# EAGLE schematic DotModuleArduinoMegaShield (EAGLE 9.1.3)
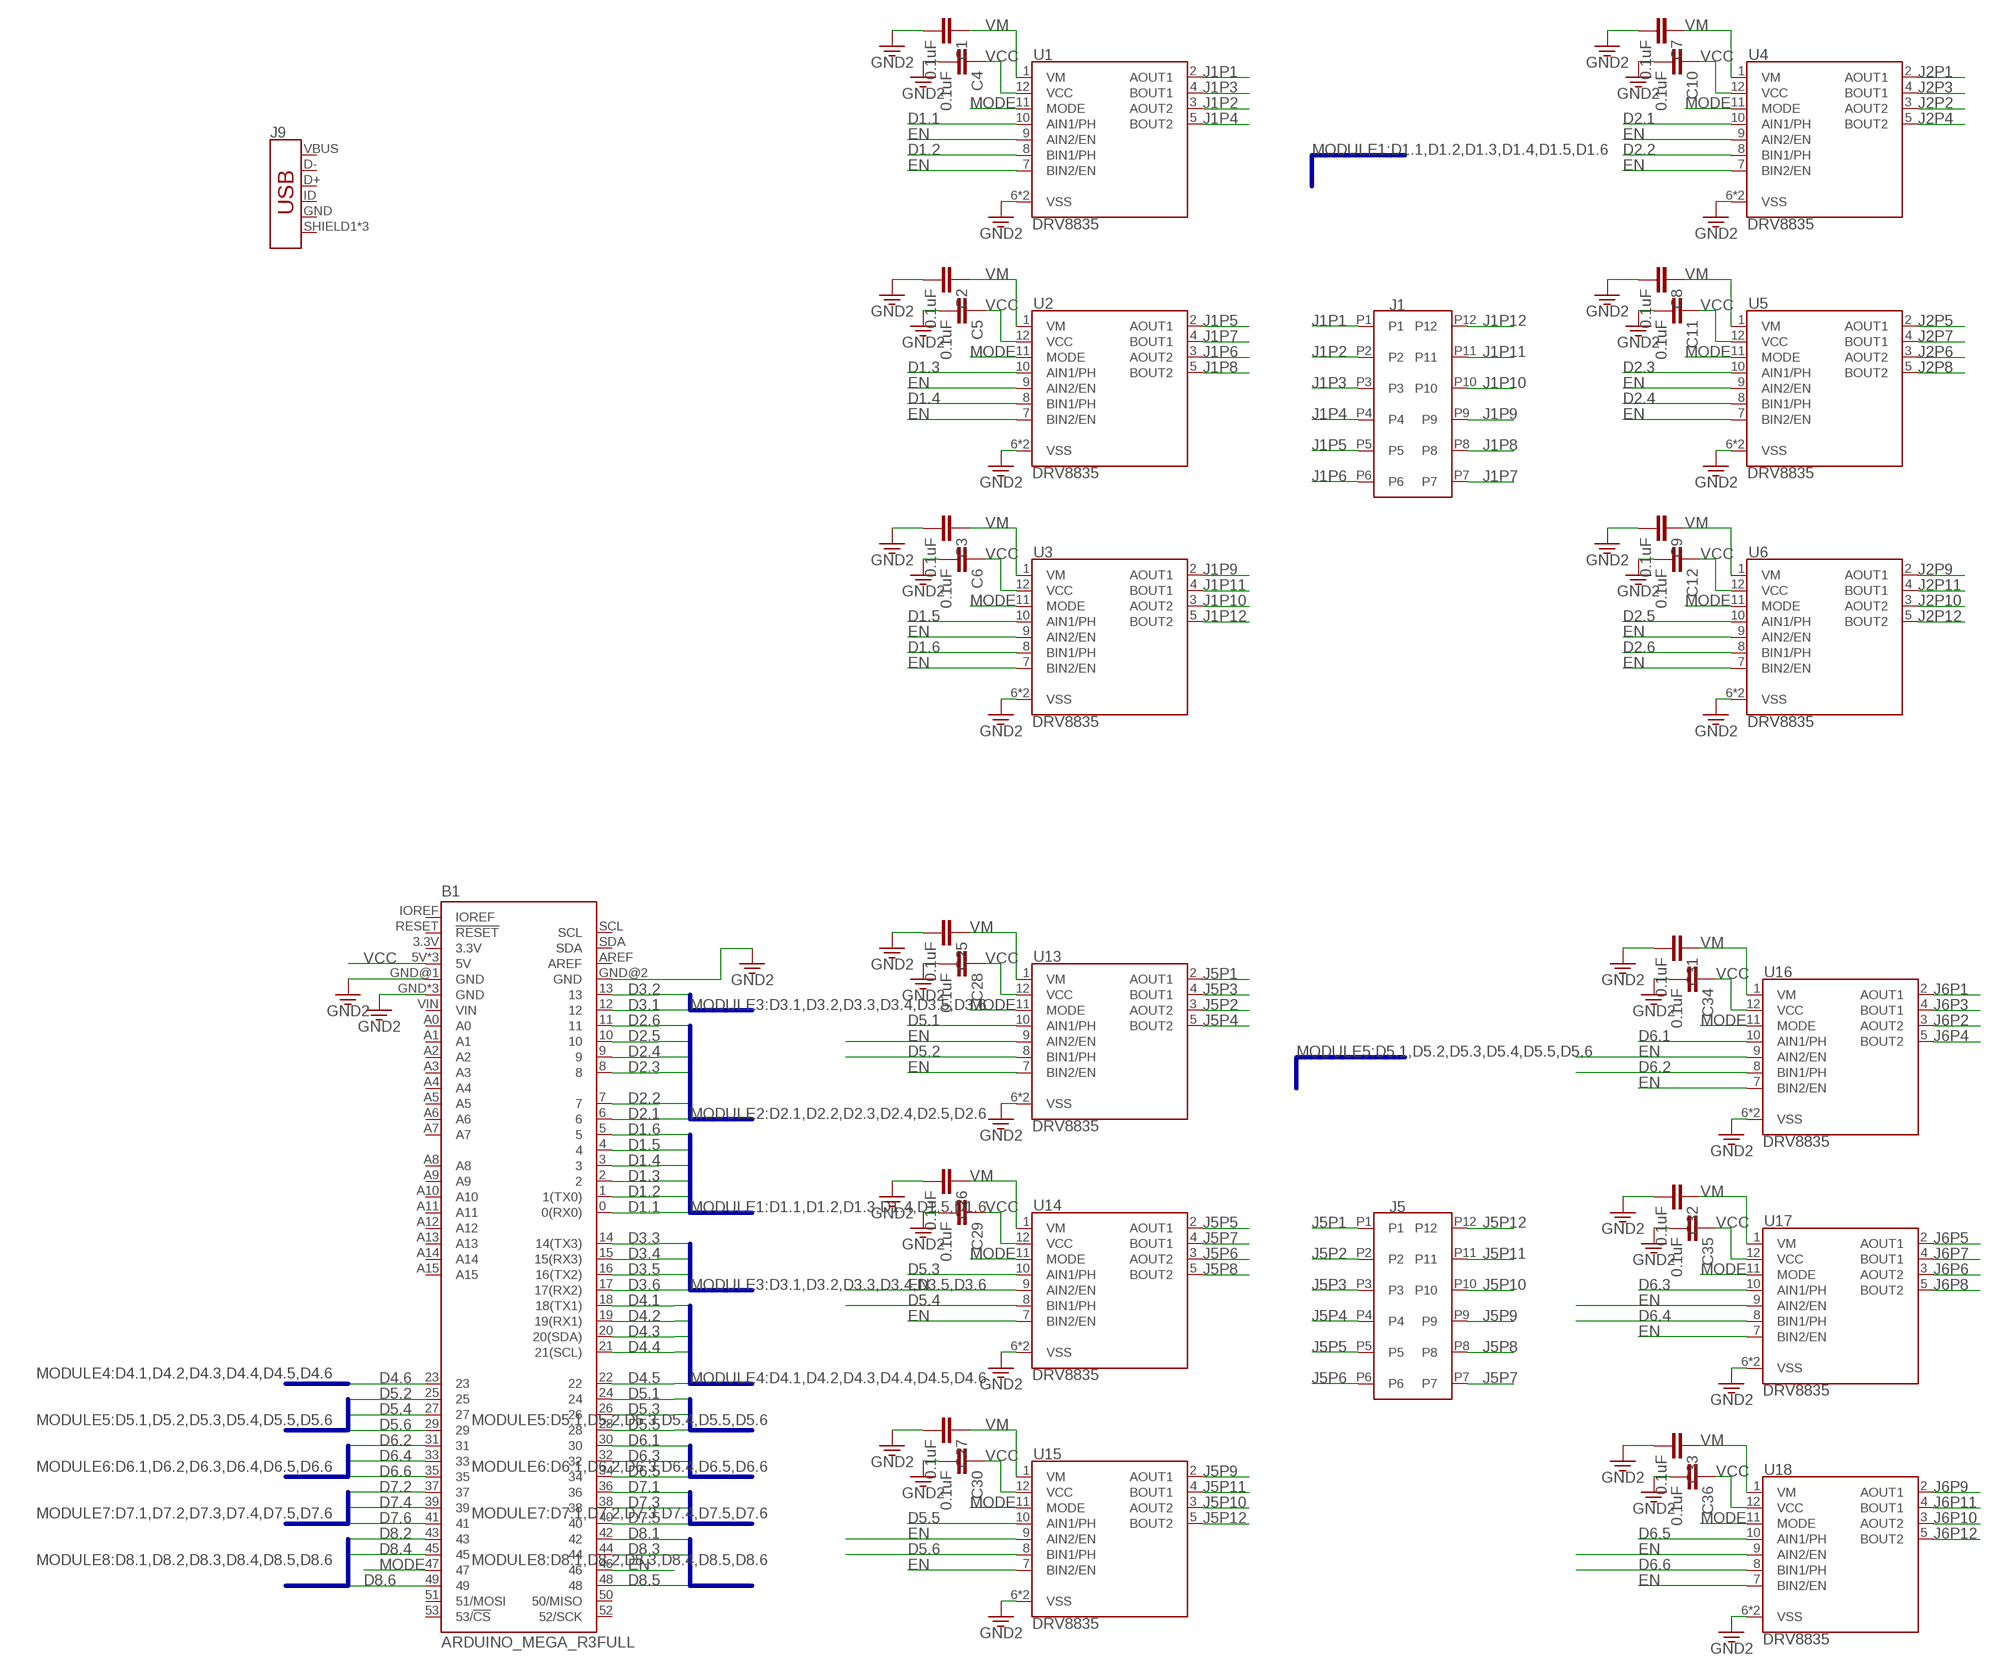
[diagram p0: schematic, sheet 1, part 1 of 2]
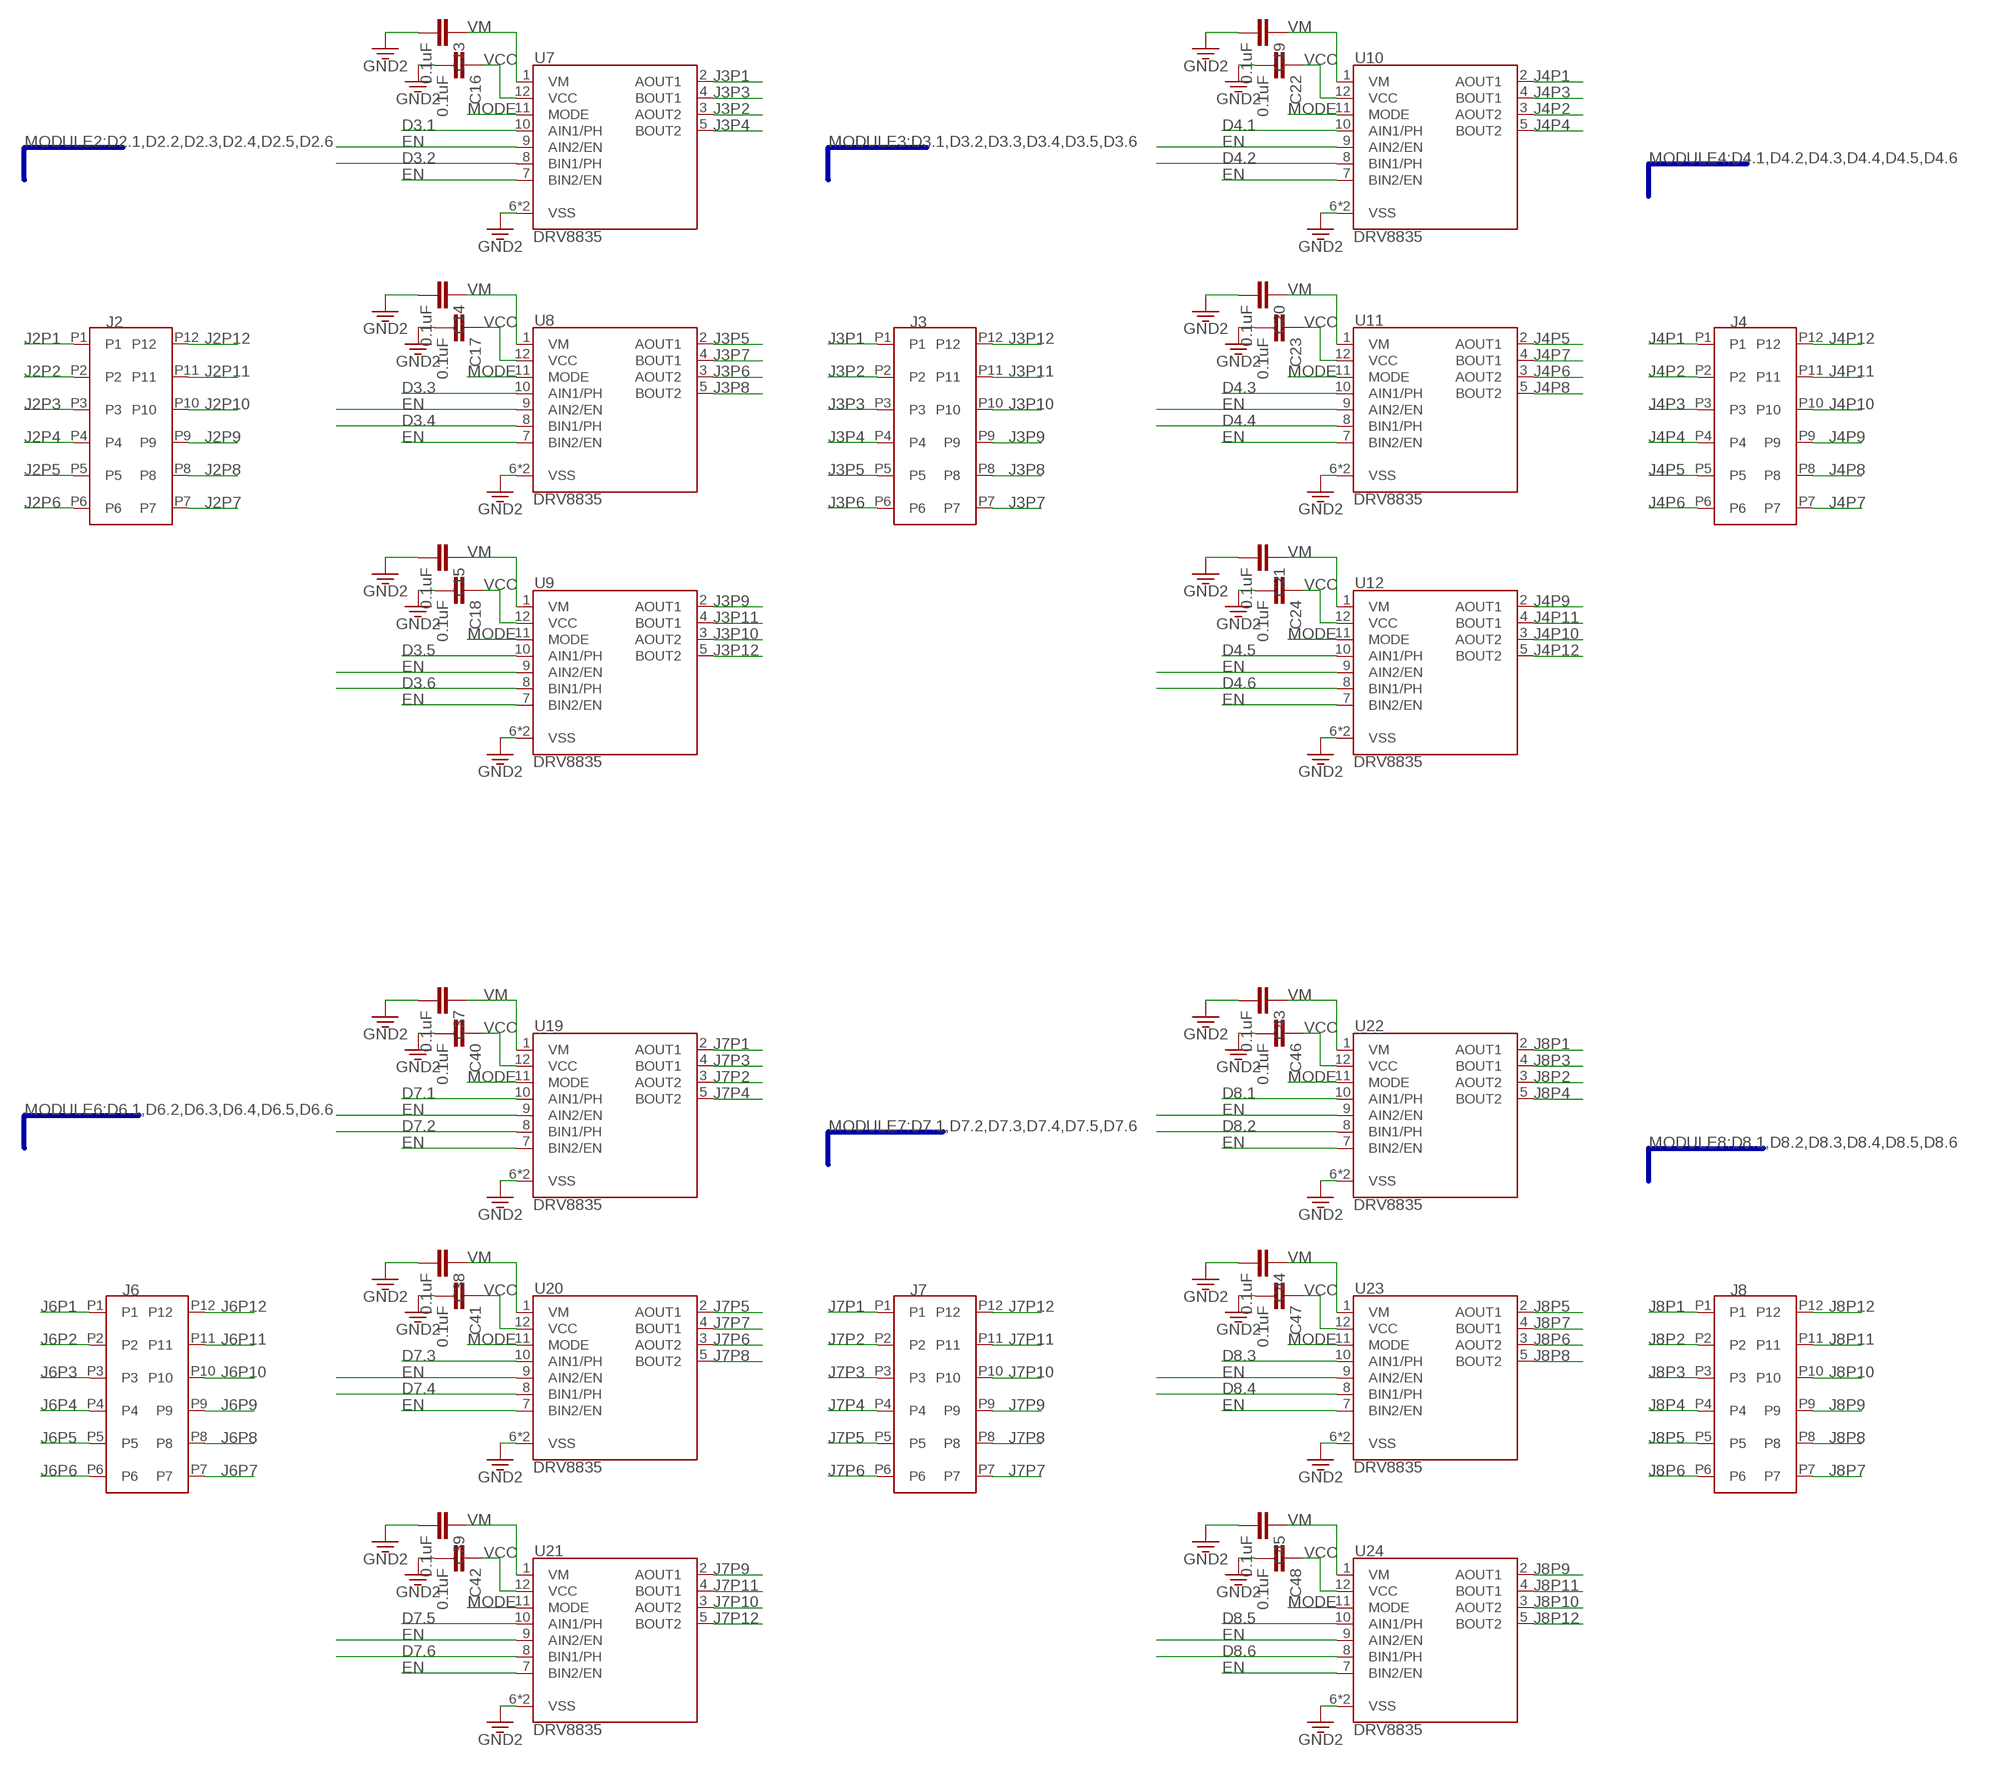
[diagram p1: schematic, sheet 1, part 2 of 2]

## Parts
B1  ARDUINO_MEGA_R3FULL  [ARDUINO_MEGA_NO_SILK]
C1  0.1uF  0.1UF-0402-16V-10%  [0402]
C2  0.1uF  0.1UF-0402-16V-10%  [0402]
C3  0.1uF  0.1UF-0402-16V-10%  [0402]
C4  0.1uF  0.1UF-0402-16V-10%  [0402]
C5  0.1uF  0.1UF-0402-16V-10%  [0402]
C6  0.1uF  0.1UF-0402-16V-10%  [0402]
C7  0.1uF  0.1UF-0402-16V-10%  [0402]
C8  0.1uF  0.1UF-0402-16V-10%  [0402]
C9  0.1uF  0.1UF-0402-16V-10%  [0402]
C10  0.1uF  0.1UF-0402-16V-10%  [0402]
C11  0.1uF  0.1UF-0402-16V-10%  [0402]
C12  0.1uF  0.1UF-0402-16V-10%  [0402]
C13  0.1uF  0.1UF-0402-16V-10%  [0402]
C14  0.1uF  0.1UF-0402-16V-10%  [0402]
C15  0.1uF  0.1UF-0402-16V-10%  [0402]
C16  0.1uF  0.1UF-0402-16V-10%  [0402]
C17  0.1uF  0.1UF-0402-16V-10%  [0402]
C18  0.1uF  0.1UF-0402-16V-10%  [0402]
C19  0.1uF  0.1UF-0402-16V-10%  [0402]
C20  0.1uF  0.1UF-0402-16V-10%  [0402]
C21  0.1uF  0.1UF-0402-16V-10%  [0402]
C22  0.1uF  0.1UF-0402-16V-10%  [0402]
C23  0.1uF  0.1UF-0402-16V-10%  [0402]
C24  0.1uF  0.1UF-0402-16V-10%  [0402]
C25  0.1uF  0.1UF-0402-16V-10%  [0402]
C26  0.1uF  0.1UF-0402-16V-10%  [0402]
C27  0.1uF  0.1UF-0402-16V-10%  [0402]
C28  0.1uF  0.1UF-0402-16V-10%  [0402]
C29  0.1uF  0.1UF-0402-16V-10%  [0402]
C30  0.1uF  0.1UF-0402-16V-10%  [0402]
C31  0.1uF  0.1UF-0402-16V-10%  [0402]
C32  0.1uF  0.1UF-0402-16V-10%  [0402]
C33  0.1uF  0.1UF-0402-16V-10%  [0402]
C34  0.1uF  0.1UF-0402-16V-10%  [0402]
C35  0.1uF  0.1UF-0402-16V-10%  [0402]
C36  0.1uF  0.1UF-0402-16V-10%  [0402]
C37  0.1uF  0.1UF-0402-16V-10%  [0402]
C38  0.1uF  0.1UF-0402-16V-10%  [0402]
C39  0.1uF  0.1UF-0402-16V-10%  [0402]
C40  0.1uF  0.1UF-0402-16V-10%  [0402]
C41  0.1uF  0.1UF-0402-16V-10%  [0402]
C42  0.1uF  0.1UF-0402-16V-10%  [0402]
C43  0.1uF  0.1UF-0402-16V-10%  [0402]
C44  0.1uF  0.1UF-0402-16V-10%  [0402]
C45  0.1uF  0.1UF-0402-16V-10%  [0402]
C46  0.1uF  0.1UF-0402-16V-10%  [0402]
C47  0.1uF  0.1UF-0402-16V-10%  [0402]
C48  0.1uF  0.1UF-0402-16V-10%  [0402]
J1  AXE612124-12PIN  [AXE612124-12PIN]
J2  AXE612124-12PIN  [AXE612124-12PIN]
J3  AXE612124-12PIN  [AXE612124-12PIN]
J4  AXE612124-12PIN  [AXE612124-12PIN]
J5  AXE612124-12PIN  [AXE612124-12PIN]
J6  AXE612124-12PIN  [AXE612124-12PIN]
J7  AXE612124-12PIN  [AXE612124-12PIN]
J8  AXE612124-12PIN  [AXE612124-12PIN]
J9  USB_MICRO-BREDUCED_PASTE  [USB-B-MICRO-SMD_RED_PASTE]
U1  DRV8835  DRV883X  [WSON-12]
U2  DRV8835  DRV883X  [WSON-12]
U3  DRV8835  DRV883X  [WSON-12]
U4  DRV8835  DRV883X  [WSON-12]
U5  DRV8835  DRV883X  [WSON-12]
U6  DRV8835  DRV883X  [WSON-12]
U7  DRV8835  DRV883X  [WSON-12]
U8  DRV8835  DRV883X  [WSON-12]
U9  DRV8835  DRV883X  [WSON-12]
U10  DRV8835  DRV883X  [WSON-12]
U11  DRV8835  DRV883X  [WSON-12]
U12  DRV8835  DRV883X  [WSON-12]
U13  DRV8835  DRV883X  [WSON-12]
U14  DRV8835  DRV883X  [WSON-12]
U15  DRV8835  DRV883X  [WSON-12]
U16  DRV8835  DRV883X  [WSON-12]
U17  DRV8835  DRV883X  [WSON-12]
U18  DRV8835  DRV883X  [WSON-12]
U19  DRV8835  DRV883X  [WSON-12]
U20  DRV8835  DRV883X  [WSON-12]
U21  DRV8835  DRV883X  [WSON-12]
U22  DRV8835  DRV883X  [WSON-12]
U23  DRV8835  DRV883X  [WSON-12]
U24  DRV8835  DRV883X  [WSON-12]

## Nets
3.3V: B1.GND@2(GND) ; supply symbol labelled GND2
D1.1: B1.0(0(RX0)) U1.10(AIN1/PH)
D1.2: B1.1(1(TX0)) U1.8(BIN1/PH)
D1.3: B1.2 U2.10(AIN1/PH)
D1.4: B1.3 U2.8(BIN1/PH)
D1.5: B1.4 U3.10(AIN1/PH)
D1.6: B1.5 U3.8(BIN1/PH)
D2.1: B1.6 U4.10(AIN1/PH)
D2.2: B1.7 U4.8(BIN1/PH)
D2.3: B1.8 U5.10(AIN1/PH)
D2.4: B1.9 U5.8(BIN1/PH)
D2.5: B1.10 U6.10(AIN1/PH)
D2.6: B1.11 U6.8(BIN1/PH)
D3.1: B1.12 U7.10(AIN1/PH)
D3.2: B1.13 U7.8(BIN1/PH)
D3.3: B1.14(14(TX3)) U8.10(AIN1/PH)
D3.4: B1.15(15(RX3)) U8.8(BIN1/PH)
D3.5: B1.16(16(TX2)) U9.10(AIN1/PH)
D3.6: B1.17(17(RX2)) U9.8(BIN1/PH)
D4.1: B1.18(18(TX1)) U10.10(AIN1/PH)
D4.2: B1.19(19(RX1)) U10.8(BIN1/PH)
D4.3: B1.20(20(SDA)) U11.10(AIN1/PH)
D4.4: B1.21(21(SCL)) U11.8(BIN1/PH)
D4.5: B1.22 U12.10(AIN1/PH)
D4.6: B1.23 U12.8(BIN1/PH)
D5.1: B1.24 U13.10(AIN1/PH)
D5.2: B1.25 U13.8(BIN1/PH)
D5.3: B1.26 U14.10(AIN1/PH)
D5.4: B1.27 U14.8(BIN1/PH)
D5.5: B1.28 U15.10(AIN1/PH)
D5.6: B1.29 U15.8(BIN1/PH)
D6.1: B1.30 U16.10(AIN1/PH)
D6.2: B1.31 U16.8(BIN1/PH)
D6.3: B1.32 U17.10(AIN1/PH)
D6.4: B1.33 U17.8(BIN1/PH)
D6.5: B1.34 U18.10(AIN1/PH)
D6.6: B1.35 U18.8(BIN1/PH)
D7.1: B1.36 U19.10(AIN1/PH)
D7.2: B1.37 U19.8(BIN1/PH)
D7.3: B1.38 U20.10(AIN1/PH)
D7.4: B1.39 U20.8(BIN1/PH)
D7.5: B1.40 U21.10(AIN1/PH)
D7.6: B1.41 U21.8(BIN1/PH)
D8.1: B1.42 U22.10(AIN1/PH)
D8.2: B1.43 U22.8(BIN1/PH)
D8.3: B1.44 U23.10(AIN1/PH)
D8.4: B1.45 U23.8(BIN1/PH)
D8.5: B1.48 U24.10(AIN1/PH)
D8.6: B1.49 U24.8(BIN1/PH)
EN: B1.46 U1.7(BIN2/EN) U1.9(AIN2/EN) U2.7(BIN2/EN) U2.9(AIN2/EN) U3.7(BIN2/EN) U3.9(AIN2/EN) U4.7(BIN2/EN) U4.9(AIN2/EN) U5.7(BIN2/EN) U5.9(AIN2/EN) U6.7(BIN2/EN) U6.9(AIN2/EN) U7.7(BIN2/EN) U7.9(AIN2/EN) U8.7(BIN2/EN) U8.9(AIN2/EN) U9.7(BIN2/EN) U9.9(AIN2/EN) U10.7(BIN2/EN) U10.9(AIN2/EN) U11.7(BIN2/EN) U11.9(AIN2/EN) U12.7(BIN2/EN) U12.9(AIN2/EN) U13.7(BIN2/EN) U13.9(AIN2/EN) U14.7(BIN2/EN) U14.9(AIN2/EN) U15.7(BIN2/EN) U15.9(AIN2/EN) U16.7(BIN2/EN) U16.9(AIN2/EN) U17.7(BIN2/EN) U17.9(AIN2/EN) U18.7(BIN2/EN) U18.9(AIN2/EN) U19.7(BIN2/EN) U19.9(AIN2/EN) U20.7(BIN2/EN) U20.9(AIN2/EN) U21.7(BIN2/EN) U21.9(AIN2/EN) U22.7(BIN2/EN) U22.9(AIN2/EN) U23.7(BIN2/EN) U23.9(AIN2/EN) U24.7(BIN2/EN) U24.9(AIN2/EN)
GND: B1.GND B1.GND@1(GND) B1.GND@3(GND) B1.GND@4(GND) C1.2 C2.2 C3.2 C4.2 C5.2 C6.2 C7.2 C8.2 C9.2 C10.2 C11.2 C12.2 C13.2 C14.2 C15.2 C16.2 C17.2 C18.2 C19.2 C20.2 C21.2 C22.2 C23.2 C24.2 C25.2 C26.2 C27.2 C28.2 C29.2 C30.2 C31.2 C32.2 C33.2 C34.2 C35.2 C36.2 C37.2 C38.2 C39.2 C40.2 C41.2 C42.2 C43.2 C44.2 C45.2 C46.2 C47.2 C48.2 U1.6(VSS) U1.PAD(VSS) U2.6(VSS) U2.PAD(VSS) U3.6(VSS) U3.PAD(VSS) U4.6(VSS) U4.PAD(VSS) U5.6(VSS) U5.PAD(VSS) U6.6(VSS) U6.PAD(VSS) U7.6(VSS) U7.PAD(VSS) U8.6(VSS) U8.PAD(VSS) U9.6(VSS) U9.PAD(VSS) U10.6(VSS) U10.PAD(VSS) U11.6(VSS) U11.PAD(VSS) U12.6(VSS) U12.PAD(VSS) U13.6(VSS) U13.PAD(VSS) U14.6(VSS) U14.PAD(VSS) U15.6(VSS) U15.PAD(VSS) U16.6(VSS) U16.PAD(VSS) U17.6(VSS) U17.PAD(VSS) U18.6(VSS) U18.PAD(VSS) U19.6(VSS) U19.PAD(VSS) U20.6(VSS) U20.PAD(VSS) U21.6(VSS) U21.PAD(VSS) U22.6(VSS) U22.PAD(VSS) U23.6(VSS) U23.PAD(VSS) U24.6(VSS) U24.PAD(VSS) ; supply symbol labelled GND2
J1P1: J1.P1 U1.2(AOUT1)
J1P2: J1.P2 U1.3(AOUT2)
J1P3: J1.P3 U1.4(BOUT1)
J1P4: J1.P4 U1.5(BOUT2)
J1P5: J1.P5 U2.2(AOUT1)
J1P6: J1.P6 U2.3(AOUT2)
J1P7: J1.P7 U2.4(BOUT1)
J1P8: J1.P8 U2.5(BOUT2)
J1P9: J1.P9 U3.2(AOUT1)
J1P10: J1.P10 U3.3(AOUT2)
J1P11: J1.P11 U3.4(BOUT1)
J1P12: J1.P12 U3.5(BOUT2)
J2P1: J2.P1 U4.2(AOUT1)
J2P2: J2.P2 U4.3(AOUT2)
J2P3: J2.P3 U4.4(BOUT1)
J2P4: J2.P4 U4.5(BOUT2)
J2P5: J2.P5 U5.2(AOUT1)
J2P6: J2.P6 U5.3(AOUT2)
J2P7: J2.P7 U5.4(BOUT1)
J2P8: J2.P8 U5.5(BOUT2)
J2P9: J2.P9 U6.2(AOUT1)
J2P10: J2.P10 U6.3(AOUT2)
J2P11: J2.P11 U6.4(BOUT1)
J2P12: J2.P12 U6.5(BOUT2)
J3P1: J3.P1 U7.2(AOUT1)
J3P2: J3.P2 U7.3(AOUT2)
J3P3: J3.P3 U7.4(BOUT1)
J3P4: J3.P4 U7.5(BOUT2)
J3P5: J3.P5 U8.2(AOUT1)
J3P6: J3.P6 U8.3(AOUT2)
J3P7: J3.P7 U8.4(BOUT1)
J3P8: J3.P8 U8.5(BOUT2)
J3P9: J3.P9 U9.2(AOUT1)
J3P10: J3.P10 U9.3(AOUT2)
J3P11: J3.P11 U9.4(BOUT1)
J3P12: J3.P12 U9.5(BOUT2)
J4P1: J4.P1 U10.2(AOUT1)
J4P2: J4.P2 U10.3(AOUT2)
J4P3: J4.P3 U10.4(BOUT1)
J4P4: J4.P4 U10.5(BOUT2)
J4P5: J4.P5 U11.2(AOUT1)
J4P6: J4.P6 U11.3(AOUT2)
J4P7: J4.P7 U11.4(BOUT1)
J4P8: J4.P8 U11.5(BOUT2)
J4P9: J4.P9 U12.2(AOUT1)
J4P10: J4.P10 U12.3(AOUT2)
J4P11: J4.P11 U12.4(BOUT1)
J4P12: J4.P12 U12.5(BOUT2)
J5P1: J5.P1 U13.2(AOUT1)
J5P2: J5.P2 U13.3(AOUT2)
J5P3: J5.P3 U13.4(BOUT1)
J5P4: J5.P4 U13.5(BOUT2)
J5P5: J5.P5 U14.2(AOUT1)
J5P6: J5.P6 U14.3(AOUT2)
J5P7: J5.P7 U14.4(BOUT1)
J5P8: J5.P8 U14.5(BOUT2)
J5P9: J5.P9 U15.2(AOUT1)
J5P10: J5.P10 U15.3(AOUT2)
J5P11: J5.P11 U15.4(BOUT1)
J5P12: J5.P12 U15.5(BOUT2)
J6P1: J6.P1 U16.2(AOUT1)
J6P2: J6.P2 U16.3(AOUT2)
J6P3: J6.P3 U16.4(BOUT1)
J6P4: J6.P4 U16.5(BOUT2)
J6P5: J6.P5 U17.2(AOUT1)
J6P6: J6.P6 U17.3(AOUT2)
J6P7: J6.P7 U17.4(BOUT1)
J6P8: J6.P8 U17.5(BOUT2)
J6P9: J6.P9 U18.2(AOUT1)
J6P10: J6.P10 U18.3(AOUT2)
J6P11: J6.P11 U18.4(BOUT1)
J6P12: J6.P12 U18.5(BOUT2)
J7P1: J7.P1 U19.2(AOUT1)
J7P2: J7.P2 U19.3(AOUT2)
J7P3: J7.P3 U19.4(BOUT1)
J7P4: J7.P4 U19.5(BOUT2)
J7P5: J7.P5 U20.2(AOUT1)
J7P6: J7.P6 U20.3(AOUT2)
J7P7: J7.P7 U20.4(BOUT1)
J7P8: J7.P8 U20.5(BOUT2)
J7P9: J7.P9 U21.2(AOUT1)
J7P10: J7.P10 U21.3(AOUT2)
J7P11: J7.P11 U21.4(BOUT1)
J7P12: J7.P12 U21.5(BOUT2)
J8P1: J8.P1 U22.2(AOUT1)
J8P2: J8.P2 U22.3(AOUT2)
J8P3: J8.P3 U22.4(BOUT1)
J8P4: J8.P4 U22.5(BOUT2)
J8P5: J8.P5 U23.2(AOUT1)
J8P6: J8.P6 U23.3(AOUT2)
J8P7: J8.P7 U23.4(BOUT1)
J8P8: J8.P8 U23.5(BOUT2)
J8P9: J8.P9 U24.2(AOUT1)
J8P10: J8.P10 U24.3(AOUT2)
J8P11: J8.P11 U24.4(BOUT1)
J8P12: J8.P12 U24.5(BOUT2)
MODE: B1.47 U1.11(MODE) U2.11(MODE) U3.11(MODE) U4.11(MODE) U5.11(MODE) U6.11(MODE) U7.11(MODE) U8.11(MODE) U9.11(MODE) U10.11(MODE) U11.11(MODE) U12.11(MODE) U13.11(MODE) U14.11(MODE) U15.11(MODE) U16.11(MODE) U17.11(MODE) U18.11(MODE) U19.11(MODE) U20.11(MODE) U21.11(MODE) U22.11(MODE) U23.11(MODE) U24.11(MODE)
VCC: B1.5V B1.5V@1(5V) B1.5V@2(5V) C4.1 C5.1 C6.1 C10.1 C11.1 C12.1 C16.1 C17.1 C18.1 C22.1 C23.1 C24.1 C28.1 C29.1 C30.1 C34.1 C35.1 C36.1 C40.1 C41.1 C42.1 C46.1 C47.1 C48.1 U1.12(VCC) U2.12(VCC) U3.12(VCC) U4.12(VCC) U5.12(VCC) U6.12(VCC) U7.12(VCC) U8.12(VCC) U9.12(VCC) U10.12(VCC) U11.12(VCC) U12.12(VCC) U13.12(VCC) U14.12(VCC) U15.12(VCC) U16.12(VCC) U17.12(VCC) U18.12(VCC) U19.12(VCC) U20.12(VCC) U21.12(VCC) U22.12(VCC) U23.12(VCC) U24.12(VCC)
VM: C1.1 C2.1 C3.1 C7.1 C8.1 C9.1 C13.1 C14.1 C15.1 C19.1 C20.1 C21.1 C25.1 C26.1 C27.1 C31.1 C32.1 C33.1 C37.1 C38.1 C39.1 C43.1 C44.1 C45.1 U1.1(VM) U2.1(VM) U3.1(VM) U4.1(VM) U5.1(VM) U6.1(VM) U7.1(VM) U8.1(VM) U9.1(VM) U10.1(VM) U11.1(VM) U12.1(VM) U13.1(VM) U14.1(VM) U15.1(VM) U16.1(VM) U17.1(VM) U18.1(VM) U19.1(VM) U20.1(VM) U21.1(VM) U22.1(VM) U23.1(VM) U24.1(VM)
Unconnected: B1.3.3V B1.50(50/MISO) B1.51(51/MOSI) B1.52(52/SCK) B1.53(53/!CS) B1.A0 B1.A1 B1.A2 B1.A3 B1.A4 B1.A5 B1.A6 B1.A7 B1.A8 B1.A9 B1.A10 B1.A11 B1.A12 B1.A13 B1.A14 B1.A15 B1.AREF B1.IOREF B1.RESET(!RESET) B1.SCL B1.SDA B1.VIN J9.D+ J9.D- J9.ID J9.SHIELD1(SHIELD) J9.SHIELD2(SHIELD) J9.SHIELD3(SHIELD)

## Buses
MODULE1:D1.1,D1.2,D1.3,D1.4,D1.5,D1.6
MODULE2:D2.1,D2.2,D2.3,D2.4,D2.5,D2.6
MODULE3:D3.1,D3.2,D3.3,D3.4,D3.5,D3.6
MODULE4:D4.1,D4.2,D4.3,D4.4,D4.5,D4.6
MODULE5:D5.1,D5.2,D5.3,D5.4,D5.5,D5.6
MODULE6:D6.1,D6.2,D6.3,D6.4,D6.5,D6.6
MODULE7:D7.1,D7.2,D7.3,D7.4,D7.5,D7.6
MODULE8:D8.1,D8.2,D8.3,D8.4,D8.5,D8.6

## Power pins joined to a net without a drawn wire
GND: J9.GND
VBUS: J9.VBUS

## Library data of the parts
B1 = SparkFun-Boards:ARDUINO_MEGA_R3: Arduino Mega R3 ATmega2560 R3 compatible footprint. SparkFun Products: Arduino Mega 2560 R3 <https://www.sparkfun.com/products/11061>
C1-C48 = SparkFun-Capacitors:0.1UF: 0.1µF ceramic capacitors A capacitor is a passive two-terminal electrical component used to store electrical energy temporarily in an electric field.; PROD_ID: CAP-12416
J1-J8 = connectors:AXE612124-12PIN: AXE612124 Narrow Pitch Connectors, 0.4mm Pitch, 12PIN, Header Datasheet:https://www.mouser.com/datasheet/2/315/a4s-catalog-1075812.pdf
J9 = SparkFun-Connectors:USB_MICRO-B: USB Type Micro-B Connector Male/female and PTH/SMT variants SparkFun Products: SparkFun microB USB Breakout <https://www.sparkfun.com/products/12035> SparkFun USB microB Plug Breakout <https://www.sparkfun.com/products/10031> SparkFun ESP8266 Thing <https://www.sparkfun.com/products/13231>; PROD_ID: CONN-11752
U1-U24 = SparkFun-IC-Special-Function:DRV883X: DRV8835 2 Channel Motor Driver Dual 1.5A H-bridge, 2-11V Datasheet <http://www.ti.com/lit/ds/symlink/drv8835.pdf> SparkFun Products: SparkFun Serial Controlled Motor Driver <https://www.sparkfun.com/products/13911>; PROD_ID: IC-13342